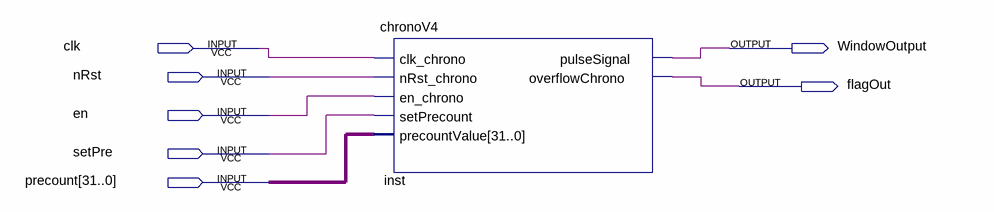
[diagram p0: schematic sheet]
// Quartus schematic testChronoVers.bdf as structural Verilog: 1 symbols, 7 pins
module testChronoVers (
  input  clk,
  input  nRst,
  input  en,
  input  setPre,
  input  [31:0] precount,
  output WindowOutput,
  output flagOut
);

  chronoV4 inst (
    .clk_chrono(clk), .nRst_chrono(nRst), .en_chrono(en), .setPrecount(setPre), .precountValue(precount),
    .pulseSignal(WindowOutput), .overflowChrono(flagOut));
endmodule
